# EAGLE design CAA-NMC (EAGLE 9.2.2)
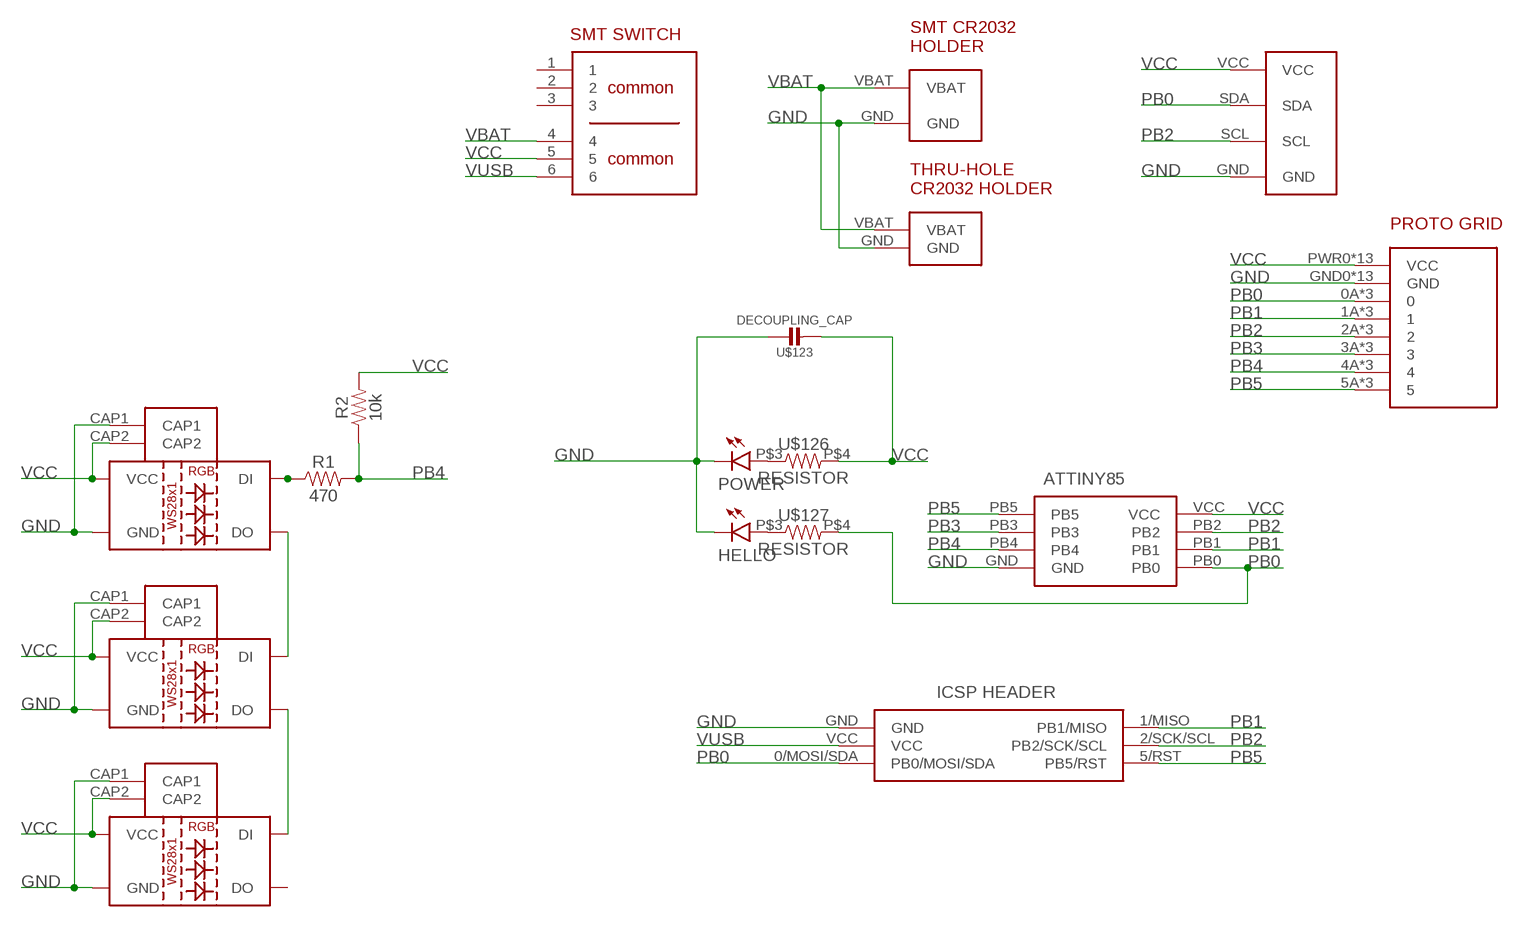
[diagram p0: schematic, sheet 1]

## Parts
D1  WS2812B  [WS2812B]
D2  WS2812B  [WS2812B]
D3  WS2812B  [WS2812B]
HELLO  LED3MM  [LED3MM]
IC1  ATTINY85-20SU  [SOT127P798X216-8N]
J1  M20-9980346  [HDRV6W64P254_2X3_762X508X868P]
POWER  LED3MM  [LED3MM]
R1  470  470OHM-0603-1/10W-1%  [0603]
R2  10k  10KOHM-0603-1/10W-1%  [0603]
U$1  PROTO  [PROTO]
U$2  SMT-BATTERY-HOLDER  [SMT-CR-HOLDER]
U$3  THRU-CR-HOLDER  [THRU-CR-HOLDER]
U$4  I2C-PADS  [I2C-PADS]
U$123  DECOUPLING_CAP  [DECOUPLING_CAP]
U$126  RESISTOR  [AXIAL-0.3]
U$127  RESISTOR  [AXIAL-0.3]
U$145  SMT-SWITCH  [SMT-SWITCH]

## Nets
GND [GND]: D1.CAP1 D1.GND D2.CAP1 D2.GND D3.CAP1 D3.GND HELLO.NEG IC1.GND J1.GND POWER.NEG U$1.GND0(GND) U$1.GND1(GND) U$1.GND2(GND) U$1.GND3(GND) U$1.GND4(GND) U$1.GND5(GND) U$1.GND6(GND) U$1.GND7(GND) U$1.GND8(GND) U$1.GND9(GND) U$1.GND10(GND) U$1.GND11(GND) U$1.GND12(GND) U$2.GND U$3.GND U$4.GND U$123.P$1
N$1: POWER.POS U$126.P$3
N$2: HELLO.POS U$127.P$3
N$3: D1.DO D2.DI
N$4: D2.DO D3.DI
N$5: D1.DI R1.1
PB0: IC1.PB0 J1.0/MOSI/SDA(PB0/MOSI/SDA) U$1.0A U$1.0B U$1.0C U$4.SDA U$127.P$4
PB1: IC1.PB1 J1.1/MISO(PB1/MISO) U$1.1A U$1.1B U$1.1C
PB2: IC1.PB2 J1.2/SCK/SCL(PB2/SCK/SCL) U$1.2A U$1.2B U$1.2C U$4.SCL
PB3: IC1.PB3 U$1.3A U$1.3B U$1.3C
PB4: IC1.PB4 R1.2 R2.1 U$1.4A U$1.4B U$1.4C
PB5: IC1.PB5 J1.5/RST(PB5/RST) U$1.5A U$1.5B U$1.5C
VBAT [VBAT]: U$2.VBAT U$3.VBAT U$145.4
VCC [VCC]: D1.CAP2 D1.VCC D2.CAP2 D2.VCC D3.CAP2 D3.VCC IC1.VCC R2.2 U$1.PWR0(VCC) U$1.PWR1(VCC) U$1.PWR2(VCC) U$1.PWR3(VCC) U$1.PWR4(VCC) U$1.PWR5(VCC) U$1.PWR6(VCC) U$1.PWR7(VCC) U$1.PWR8(VCC) U$1.PWR9(VCC) U$1.PWR10(VCC) U$1.PWR11(VCC) U$1.PWR12(VCC) U$4.VCC U$123.P$2 U$126.P$4 U$145.5
VUSB: J1.VCC U$145.6
Unconnected: D3.DO U$145.1 U$145.2 U$145.3

## Library data of the parts
D1-D3 = BadgeParts:WS2812B: WS2812B SMD addressable RGB LED 5x5mm SMD LED with built-in controller IC. Color: Red/Green/Blue mC Rating: RGB: 390, 660, 180 mcd Forward Voltage: RGB: 2.0, 3.0, 3.0 V Packages:WS2812B SparkFun Products: Blynk Board - ESP8266 <https://www.sparkfun.com/products/13794>; PROD_ID: DIO-12503
HELLO POWER = BadgeParts:LED3MM
IC1 = BadgeParts:ATTINY85-20SU: MICROCHIP - ATTINY85-20SU - MICROCONTROLLER MCU, 8 BIT, ATTINY, 20MHZ, SOIC-8 Source: Datasheet <https://componentsearchengine.com/Datasheets/2/ATTINY85-20SU.pdf>; ARROW_PART_NUMBER: ATTINY85-20SU; ARROW_PRICE/STOCK: https://www.arrow.com/en/products/attiny85-20su/microchip-technology; DESCRIPTION: MICROCHIP - ATTINY85-20SU - MICROCONTROLLER MCU, 8 BIT, ATTINY, 20MHZ, SOIC-8; HEIGHT: 2.16mm; MANUFACTURER_NAME: Microchip; MANUFACTURER_PART_NUMBER: ATTINY85-20SU; RS_PART_NUMBER: 1331674; RS_PRICE/STOCK: http://uk.rs-online.com/web/p/products/1331674
J1 = BadgeParts:M20-9980346: 03+03 DIL Vertical Pin Header HARWIN M20 Series, 2.54mm Pitch 6 Way 2 Row Straight PCB Header, Solder Termination, 3A Source: Datasheet <https://cdn.harwin.com/pdfs/M20-998.pdf?utm_source=3D_PDF&utm_medium=3D_PDF&utm_campaign=3D_PDF>; ARROW_PART_NUMBER: M20-9980346; ARROW_PRICE/STOCK: http://uk.rs-online.com/web/p/products/7457046P; DESCRIPTION: 03+03 DIL Vertical Pin Header HARWIN M20 Series, 2.54mm Pitch 6 Way 2 Row Straight PCB Header, Solder Termination, 3A; HEIGHT: 8.68mm; MANUFACTURER_NAME: HARWIN; MANUFACTURER_PART_NUMBER: M20-9980346; RS_PART_NUMBER: 7457046P; RS_PRICE/STOCK: http://uk.rs-online.com/web/p/products/7457046P
R1 = SparkFun-Resistors:470OHM: 470Ω resistor A resistor is a passive two-terminal electrical component that implements electrical resistance as a circuit element. Resistors act to reduce current flow, and, at the same time, act to lower voltage levels within circuits. - Wikipedia; PROD_ID: RES-07869
R2 = SparkFun-Resistors:10KOHM: 10kΩ resistor A resistor is a passive two-terminal electrical component that implements electrical resistance as a circuit element. Resistors act to reduce current flow, and, at the same time, act to lower voltage levels within circuits. - Wikipedia; PROD_ID: RES-00824
U$1 = BadgeParts:PROTO
U$2 = BadgeParts:SMT-BATTERY-HOLDER
U$3 = BadgeParts:THRU-CR-HOLDER
U$4 = BadgeParts:I2C-PADS
U$123 = BadgeParts:DECOUPLING_CAP
U$126 U$127 = BadgeParts:RESISTOR
U$145 = BadgeParts:SMT-SWITCH

## Net classes
0 default: width 0.254 mm, clearance 0.254 mm
1 VCC: width 0.381 mm, clearance 0.254 mm
2 GND: width 0.381 mm, clearance 0.254 mm
3 VBAT: width 0.381 mm, clearance 0.254 mm

## Board
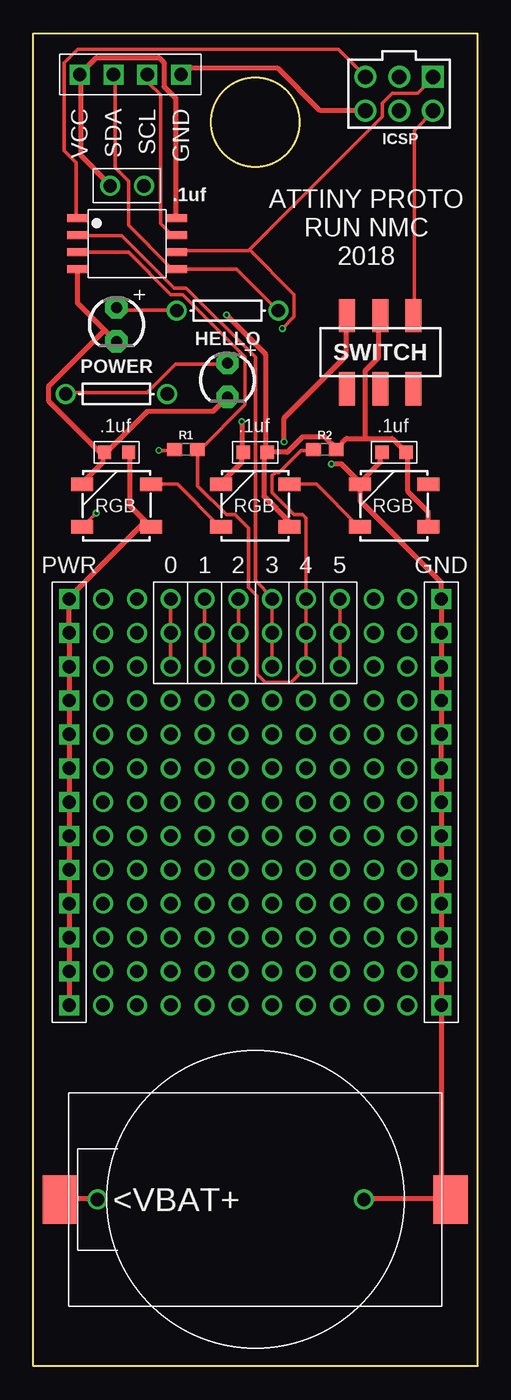
[diagram p1: board, top side]
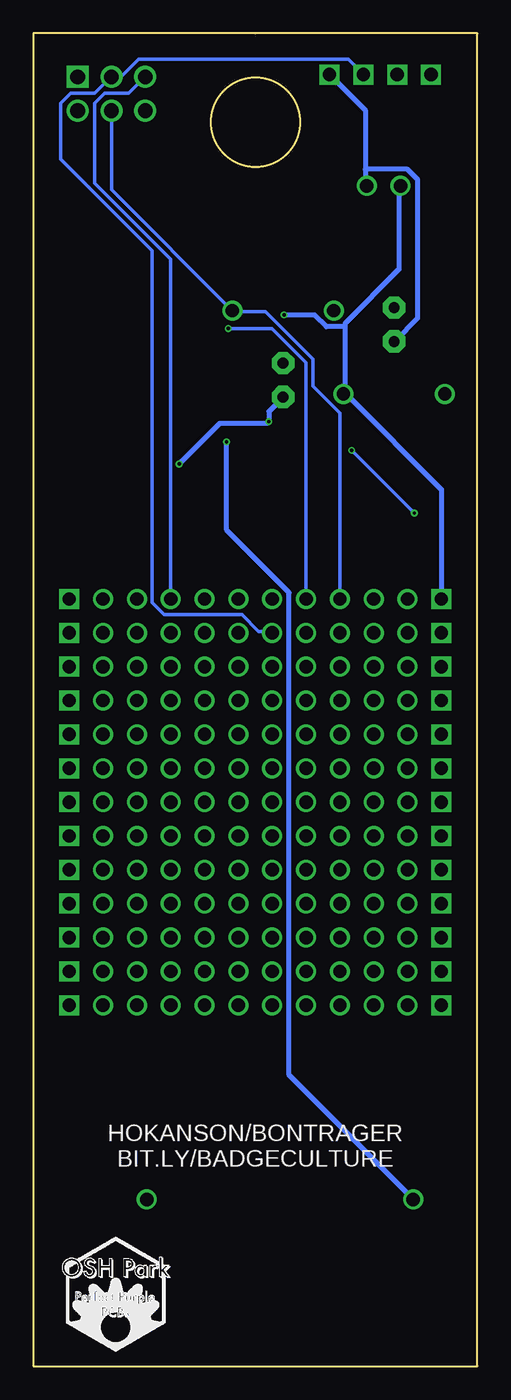
[diagram p2: board, bottom side, seen from below]

Size 33.33 x 100 mm. Coordinates in mm from the lower left corner, seen from the top.
Outline: 0,100 0,0 33.33,0 33.33,100 0,100
Outline: 0,100 16.67,100
Outline: circle at 16.66,93.32 radius 3.33
Copper layers (1*16): Top 0.035559375mm / dielectric 1.6mm / Bottom 0.035559375mm
Design rules "oshpark-2layer": minimum track width 6mil, minimum drill 10mil, track to track 6mil, track to pad 6mil, pad to pad 6mil, via to via 6mil, smd to smd 6mil, copper to edge 15mil, drill to drill 6mil, minimum pad ring 5mil, minimum via ring 5mil, stop-mask expansion 2.5mil, vias tented up to drill 0mil, thermal gap 10mil

### Footprints (pad centres in the part's own frame; a part is rotated, then mirrored left to right if it is on the bottom)
WS2812B = smd 1 x 1: CAP1 -0.9,4; CAP2 0.9,4 | smd 1.651 x 1: DI -2.577,-1.6; DO 2.577,1.6; GND -2.577,1.6; VCC 2.577,-1.6
LED3MM = drill 0.813 pad 1.676 octagon: NEG 1.27,0; POS -1.27,0
SOT127P798X216-8N = smd 1.5 x 0.6: GND -3.75,-1.905; PB0 3.75,-1.905; PB1 3.75,-0.635; PB2 3.75,0.635; PB3 -3.75,0.635; PB4 -3.75,-0.635; PB5 -3.75,1.905; VCC 3.75,1.905
HDRV6W64P254_2X3_762X508X868P = drill 1.1 pad 1.65: 0/MOSI/SDA 0,1.27; 2/SCK/SCL 0,3.81; 5/RST -2.54,3.81; GND -2.54,1.27; VCC 2.54,1.27 | drill 1.1 pad 1.65 square: 1/MISO 2.54,3.81
0603 = smd 1.1 x 1: 1 -0.85,0; 2 0.85,0
PROTO = drill 1: 0A -6.35,30.48; 0B -6.35,27.94; 0C -6.35,25.4; 1A -3.81,30.48; 1B -3.81,27.94; 1C -3.81,25.4; 2A -1.27,30.48; 2B -1.27,27.94; 2C -1.27,25.4; 3A 1.27,30.48; 3B 1.27,27.94; 3C 1.27,25.4; 4A 3.81,30.48; 4B 3.81,27.94; 4C 3.81,25.4; 5A 6.35,30.48; 5B 6.35,27.94; 5C 6.35,25.4; VSTRIP1 -8.89,22.86; VSTRIP2 -8.89,20.32; VSTRIP3 -8.89,17.78; VSTRIP4 -8.89,15.24; VSTRIP5 -8.89,12.7; VSTRIP6 -6.35,22.86; VSTRIP7 -6.35,20.32; VSTRIP8 -6.35,17.78; VSTRIP9 -6.35,15.24; VSTRIP10 -6.35,12.7; VSTRIP11 -11.43,10.16; VSTRIP12 -11.43,7.62; VSTRIP13 -11.43,5.08; VSTRIP14 -11.43,2.54; VSTRIP15 -11.43,0; VSTRIP16 -3.81,22.86; VSTRIP17 -3.81,20.32; VSTRIP18 -3.81,17.78; VSTRIP19 -3.81,15.24; VSTRIP20 -3.81,12.7; VSTRIP21 -1.27,22.86; VSTRIP22 -1.27,20.32; VSTRIP23 -1.27,17.78; VSTRIP24 -1.27,15.24; VSTRIP25 -1.27,12.7; VSTRIP26 1.27,22.86; VSTRIP27 1.27,20.32; VSTRIP28 1.27,17.78; VSTRIP29 1.27,15.24; VSTRIP30 1.27,12.7; VSTRIP31 3.81,22.86; VSTRIP32 3.81,20.32; VSTRIP33 3.81,17.78; VSTRIP34 3.81,15.24; VSTRIP35 3.81,12.7; VSTRIP36 6.35,22.86; VSTRIP37 6.35,20.32; VSTRIP38 6.35,17.78; VSTRIP39 6.35,15.24; VSTRIP40 6.35,12.7; VSTRIP41 8.89,22.86; VSTRIP42 8.89,20.32; VSTRIP43 8.89,17.78; VSTRIP44 8.89,15.24; VSTRIP45 8.89,12.7; VSTRIP46 11.43,22.86; VSTRIP47 11.43,20.32; VSTRIP48 11.43,17.78; VSTRIP49 11.43,15.24; VSTRIP50 11.43,12.7; VSTRIP51 -11.43,22.86; VSTRIP52 -11.43,20.32; VSTRIP53 -11.43,17.78; VSTRIP54 -11.43,15.24; VSTRIP55 -8.89,10.16; VSTRIP56 -8.89,7.62; VSTRIP57 -8.89,5.08; VSTRIP58 -8.89,2.54; VSTRIP59 -8.89,0; VSTRIP60 -11.43,12.7; VSTRIP61 -8.89,30.48; VSTRIP62 -8.89,27.94; VSTRIP63 -8.89,25.4; VSTRIP64 -11.43,30.48; VSTRIP65 -11.43,27.94; VSTRIP66 -11.43,25.4; VSTRIP67 8.89,30.48; VSTRIP68 8.89,27.94; VSTRIP69 8.89,25.4; VSTRIP70 11.43,30.48; VSTRIP71 11.43,27.94; VSTRIP72 11.43,25.4; VSTRIP75 -6.35,10.16; VSTRIP76 -6.35,7.62; VSTRIP77 -6.35,5.08; VSTRIP78 -6.35,2.54; VSTRIP79 -6.35,0; VSTRIP95 -3.81,10.16; VSTRIP96 -3.81,7.62; VSTRIP97 -3.81,5.08; VSTRIP98 -3.81,2.54; VSTRIP99 -3.81,0; VSTRIP115 -1.27,10.16; VSTRIP116 -1.27,7.62; VSTRIP117 -1.27,5.08; VSTRIP118 -1.27,2.54; VSTRIP119 -1.27,0; VSTRIP135 1.27,10.16; VSTRIP136 1.27,7.62; VSTRIP137 1.27,5.08; VSTRIP138 1.27,2.54; VSTRIP139 1.27,0; VSTRIP155 3.81,10.16; VSTRIP156 3.81,7.62; VSTRIP157 3.81,5.08; VSTRIP158 3.81,2.54; VSTRIP159 3.81,0; VSTRIP175 6.35,10.16; VSTRIP176 6.35,7.62; VSTRIP177 6.35,5.08; VSTRIP178 6.35,2.54; VSTRIP179 6.35,0; VSTRIP195 8.89,10.16; VSTRIP196 8.89,7.62; VSTRIP197 8.89,5.08; VSTRIP198 8.89,2.54; VSTRIP199 8.89,0; VSTRIP215 11.43,10.16; VSTRIP216 11.43,7.62; VSTRIP217 11.43,5.08; VSTRIP218 11.43,2.54; VSTRIP219 11.43,0 | drill 1 square: GND0 13.97,0; GND1 13.97,2.54; GND2 13.97,5.08; GND3 13.97,7.62; GND4 13.97,10.16; GND5 13.97,12.7; GND6 13.97,15.24; GND7 13.97,17.78; GND8 13.97,20.32; GND9 13.97,22.86; GND10 13.97,25.4; GND11 13.97,27.94; GND12 13.97,30.48; PWR0 -13.97,0; PWR1 -13.97,2.54; PWR2 -13.97,5.08; PWR3 -13.97,7.62; PWR4 -13.97,10.16; PWR5 -13.97,12.7; PWR6 -13.97,15.24; PWR7 -13.97,17.78; PWR8 -13.97,20.32; PWR9 -13.97,22.86; PWR10 -13.97,25.4; PWR11 -13.97,27.94; PWR12 -13.97,30.48
SMT-CR-HOLDER = smd 2.6 x 3.65: GND 14.65,0; VBAT -14.65,0
THRU-CR-HOLDER = drill 1: GND 8.15,0; VBAT -11.85,0
I2C-PADS = drill 1 square: GND 0,3.81; SCL 0,1.27; SDA 0,-1.27; VCC 0,-3.81
DECOUPLING_CAP = drill 1: P$1 0,0; P$2 2.54,0
AXIAL-0.3 = drill 1: P$3 -3.81,0; P$4 3.81,0
SMT-SWITCH = smd 1.2 x 2.5: 1 -2.5,-2.75; 2 0,-2.75; 3 2.5,-2.75; 4 -2.5,2.75; 5 0,2.75; 6 2.5,2.75

### Placement (x,y rotation side)
D1  6.25,64.57 0 top
D2  16.66,64.57 0 top
D3  27.09,64.57 0 top
HELLO  6.25,78.15 270 top
IC1  7.03,84.22 0 top
J1  27.47,92.93 0 top
POWER  14.58,73.98 270 top
R1  11.46,68.77 0 top
R2  21.88,68.77 0 top
U$1  16.67,27.08 0 top
U$2  16.67,12.5 0 top
U$3  16.67,12.5 0 top
U$4  7.29,96.91 270 top
U$5  [OSHPARK_LOGOHEX]  31.25,1.04 0 bottom
U$123  8.3,88.56 180 top
U$126  6.25,72.94 0 top
U$127  14.58,79.19 0 top
U$145  26.04,76.07 0 top

### Tracks (layer width: path | path; a pad name or v marks a point on that pad's centre or on a via)
GND  (via drill 0.25)
  Top 0.381: J1.GND 24.92,94.23 21.49,94.23 18.32,97.41 11.59,97.41 11.21,97.03 U$4.GND | 5.36,77.72 6.12,76.96 HELLO.NEG | 5.36,77.72 3.33,79.76 3.33,82.3 IC1.GND | D2.GND 14.13,66.29 15.65,67.82 15.65,68.45 D2.CAP1 15.65,68.71 v15.65,70.87 | D1.CAP1 5.24,68.45 5.24,67.82 3.71,66.29 D1.GND | D1.CAP1 5.49,68.58 8.54,71.63 13.49,71.63 14.51,72.64 POWER.NEG | 5.36,77.72 1.17,73.53 1.17,72.39 5.11,68.45 D1.CAP1 | D3.CAP1 26.06,68.45 26.06,67.82 24.54,66.29 D3.GND | D3.GND 24.54,66.04 24.54,64.9 30.64,58.8 U$1.GND12 U$1.GND11 U$1.GND10 U$1.GND9 U$1.GND8 U$1.GND7 U$1.GND6 U$1.GND5 U$1.GND4 U$1.GND3 U$1.GND2 U$1.GND1 U$1.GND0 30.64,12.7 U$2.GND 31.27,12.57 24.92,12.57 U$3.GND | v22.38,67.69 23.14,67.69 24.41,66.42 D3.GND
  Bottom 0.381: 8.41,89.79 8.41,94.23 11.08,96.9 U$4.GND | 8.41,89.79 8.41,88.65 U$123.P$1 | POWER.NEG 14.63,72.64 15.65,71.63 v15.65,70.87 15.78,70.74 19.33,70.74 v22.38,67.69 | 8.41,89.79 5.24,89.79 4.47,89.03 4.47,78.61 6.12,76.96 HELLO.NEG
N$1
  Top 0.254: U$126.P$3 2.44,73.03 8.54,73.03 10.7,75.18 14.51,75.18 POWER.POS
N$2
  Top 0.254: U$127.P$3 10.7,79.25 6.38,79.25 6.25,79.38 HELLO.POS
N$3
  Top 0.254: D1.DO 8.92,66.17 10.82,66.17 14,62.99 D2.DI
N$4
  Top 0.254: D2.DO 19.33,66.17 21.24,66.17 24.41,62.99 D3.DI
N$5  (via drill 0.25)
  Top 0.254: v9.43,68.71 10.57,68.71 R1.1 | v4.73,64.01 3.71,62.99 D1.DI
  Bottom 0.254: v4.73,64.01 v9.43,68.71
PB0
  Top 0.254: U$1.0C U$1.0B U$1.0A | U$127.P$4 18.32,79.25 15.27,82.3 10.82,82.3 IC1.PB0 10.7,82.42 10.32,82.42 7.14,85.6 7.14,88.9 6.12,89.92 6.12,96.9 U$4.SDA
  Bottom 0.254: J1.0/MOSI/SDA 27.46,94.11 27.46,88.27 18.44,79.25 U$127.P$4 18.32,79.12 15.9,79.12 12.35,75.56 12.35,73.53 10.32,71.5 U$1.0A
PB1  (via drill 0.25)
  Top 0.254: U$1.1C U$1.1B U$1.1A | 16.22,83.76 26.19,93.73 26.19,94.74 26.95,95.5 28.86,95.5 30,96.65 J1.1/MISO | 16.22,83.76 16.16,83.69 10.82,83.69 IC1.PB1 | v18.7,77.85 19.59,78.74 19.59,80.39 16.22,83.76
  Bottom 0.254: U$1.1A 12.86,75.31 15.4,77.85 v18.7,77.85
PB2
  Top 0.254: U$1.2C U$1.2B U$1.2A | IC1.PB2 10.7,84.96 10.32,84.96 9.55,85.72 9.55,95.38 8.67,96.27 8.67,96.9 U$4.SCL
  Bottom 0.254: U$4.SCL 8.67,97.03 9.68,98.04 25.43,98.04 26.7,96.77 27.46,96.77 J1.2/SCK/SCL 27.59,96.65 28.73,95.5 30.51,95.5 31.27,94.74 31.27,90.55 24.41,83.69 24.41,57.28 23.52,56.39 17.68,56.39 16.41,55.12 15.4,55.12 U$1.2B
PB3
  Top 0.254: U$1.3C U$1.3B U$1.3A 17.94,57.66 16.67,58.93 16.67,75.69 11.46,80.9 10.57,80.9 6.63,84.84 3.33,84.84 IC1.PB3
PB4
  Top 0.254: R2.1 20.98,68.71 20.09,68.71 18.44,67.06 18.19,67.06 17.94,66.8 17.94,65.53 19.59,63.88 20.22,63.88 20.48,63.63 U$1.4A U$1.4B U$1.4C 20.48,52.45 19.33,51.31 17.43,51.31 16.79,51.94 16.79,57.78 16.16,58.42 16.16,62.87 15.14,63.88 14.51,63.88 12.35,66.04 12.35,68.71 R1.2 12.48,68.71 15.9,72.14 15.9,75.69 11.21,80.39 10.32,80.39 7.14,83.57 3.33,83.57 IC1.PB4
PB5
  Top 0.254: U$1.5C U$1.5B U$1.5A | IC1.PB5 3.2,86.23 3.2,90.3 2.31,91.19 2.31,97.79 3.33,98.81 22.89,98.81 24.92,96.77 J1.5/RST
  Bottom 0.254: U$1.5A 23.02,83.06 28.73,88.77 28.73,94.74 27.97,95.5 26.19,95.5 25.05,96.65 J1.5/RST
VBAT  (via drill 0.25)
  Top 0.381: v18.82,69.34 18.82,71.12 23.52,75.82 23.52,78.74 U$145.4 | U$2.VBAT 2.06,12.57 4.73,12.57 U$3.VBAT
  Bottom 0.381: v18.82,69.34 18.82,62.74 14.13,58.04 14.13,21.84 4.86,12.57 U$3.VBAT
VCC  (via drill 0.25)
  Top 0.381: U$1.PWR0 U$1.PWR1 U$1.PWR2 U$1.PWR3 U$1.PWR4 U$1.PWR5 U$1.PWR6 U$1.PWR7 U$1.PWR8 U$1.PWR9 U$1.PWR10 U$1.PWR11 U$1.PWR12 2.7,57.66 8.28,63.25 D1.VCC 8.79,62.99 7.27,64.52 7.27,68.45 D1.CAP2 | D2.CAP2 17.68,68.58 19.08,68.58 20.22,69.72 21.87,69.72 22.76,68.83 R2.2 22.89,68.96 23.52,69.6 24.92,69.6 | 24.92,69.6 26.95,69.6 27.97,68.58 D3.CAP2 28.1,68.45 28.1,65.66 29.62,64.14 29.62,62.99 D3.VCC | D2.VCC 19.21,62.99 19.21,63.37 17.3,65.28 17.3,68.33 17.43,68.45 D2.CAP2 | 24.92,69.6 24.92,74.68 25.94,75.69 25.94,78.74 U$145.5 | IC1.VCC 10.7,86.23 10.7,95.12 9.81,96.01 9.81,97.79 9.43,98.17 4.73,98.17 3.59,97.03 U$4.VCC 3.59,96.77 3.59,90.81 5.74,88.65 U$123.P$2 | v14.51,78.87 17.43,75.95 17.43,68.71 D2.CAP2
  Bottom 0.381: 9.94,77.98 9.94,78.23 5.87,82.3 5.87,88.52 U$123.P$2 | 9.94,77.98 9.94,73.03 U$126.P$4 9.81,72.9 2.7,65.79 U$1.PWR12 | v14.51,78.87 12.22,78.87 11.33,77.98 9.94,77.98
VUSB
  Top 0.254: U$145.6 28.6,78.87 28.6,92.71 30,94.11 J1.VCC

### Text on the board
tPlace: .1uf | ATTINY PROTO / RUN NMC / 2018 | HELLO | POWER
bPlace: HOKANSON/BONTRAGER / BIT.LY/BADGECULTURE